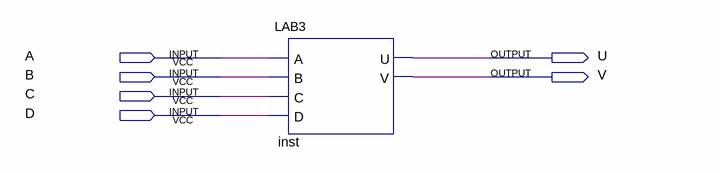
[diagram p0: schematic sheet]
// Quartus schematic LAB3_129.bdf as structural Verilog: 1 symbols, 6 pins
module LAB3_129 (
  input  A,
  input  B,
  input  C,
  input  D,
  output U,
  output V
);

  LAB3 inst (.A(A), .B(B), .C(C), .D(D), .U(U), .V(V));
endmodule
